# Altium schematic sheet hall_switches.SchDoc
size 431 x 279 mm; SheetNumber: 1; SheetTotal: 1; ENG_APP_DATE: --/--/--; DSN_APP_DATE: --/--/--; CHK_APP_DATE: --/--/--
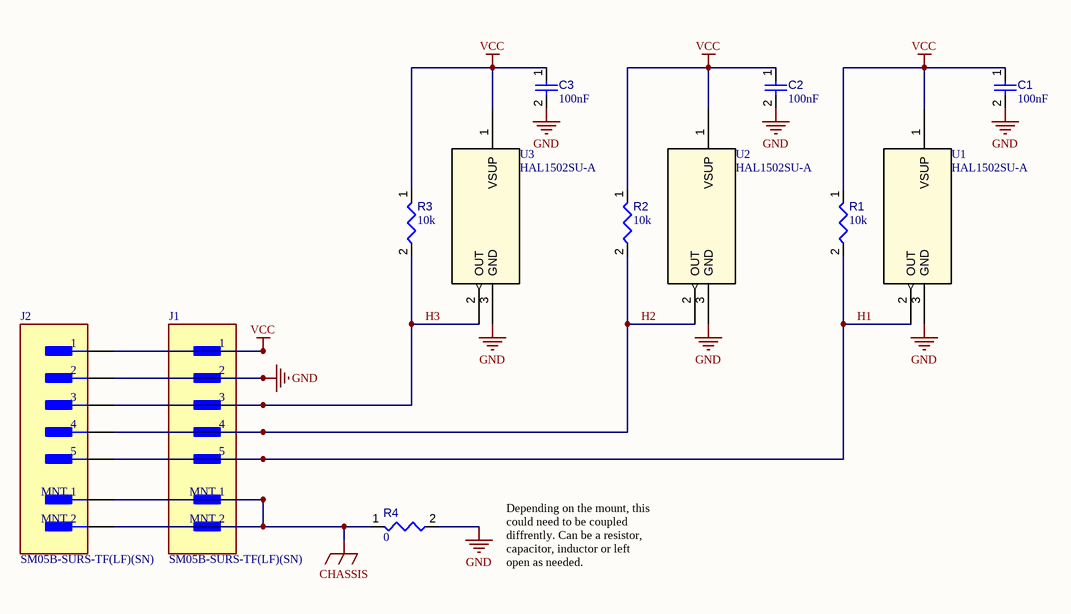
[diagram p0: hall_switches.SchDoc]

## Parts
C1  value 100nF  [CAPC2013X95X50ML10T25]  (hidden comment: Capacitor 100 nF +/-10% 50 V 0805)
C2  value 100nF  [CAPC2013X95X50ML10T25]  (hidden comment: Capacitor 100 nF +/-10% 50 V 0805)
C3  value 100nF  [CAPC2013X95X50ML10T25]  (hidden comment: Capacitor 100 nF +/-10% 50 V 0805)
J1  SM05B-SURS-TF(LF)(SN)  [FP-SM05B-SURS-TF_LF_SN-MFG]
J2  SM05B-SURS-TF(LF)(SN)  [FP-SM05B-SURS-TF_LF_SN-MFG]
R1  value 10k  [RESC2013X50X35ML15T15]  (hidden comment: Resistor 10k +/-1% 0805 125 mW)
R2  value 10k  [RESC2013X50X35ML15T15]  (hidden comment: Resistor 10k +/-1% 0805 125 mW)
R3  value 10k  [RESC2013X50X35ML15T15]  (hidden comment: Resistor 10k +/-1% 0805 125 mW)
R4  0  [RESC0805(2012)_L]
U1  HAL1502SU-A  [SOT-23_TO-236_TDK]
U2  HAL1502SU-A  [SOT-23_TO-236_TDK]
U3  HAL1502SU-A  [SOT-23_TO-236_TDK]

## Nets
CHASSIS: J1.6(MNT_1) J1.7(MNT_2) J2.6(MNT_1) J2.7(MNT_2) R4.1
GND: C1.2 C2.2 C3.2 J1.2 J2.2 R4.2 U1.3(GND) U2.3(GND) U3.3(GND)
VCC: C1.1 C2.1 C3.1 J1.1 J2.1 R1.1 R2.1 R3.1 U1.1(VSUP) U2.1(VSUP) U3.1(VSUP)
H1: J1.5 J2.5 R1.2 U1.2(OUT)
H2: J1.4 J2.4 R2.2 U2.2(OUT)
H3: J1.3 J2.3 R3.2 U3.2(OUT)

## Notes on the sheet
- Depending on the mount, this could need to be coupled diffrently. Can be a resistor, capacitor, inductor or left open as needed.
- DWG. NO.
- REV.
- SHT.
- THIS DOCUMENT AND THE DATA DISCLOSED HEREIN OR HEREWITH IS THE PROPERTY OF ALTIUM LIMITED AND MAY BE FREELY DISTRIBUTED IN WHOLE. NO RIGHTS ARE RESERVED OR EXPRESS OR IMPLIED WARANTEE GIVEN.
- REVISION
- DESCRIPTION
- DATE
- APPROVED
- ENG:
- APPROVALS
- PROJECT
- DSN:
- CHK:
- REFERENCE DOCUMENTS
- PROJECT REVISION:
- TITLE
- DOCUMENT REVISION:
- DESIGN ITEM:
- BOM:
- FAB DWG:
- PCB DWG:
- ASSY DWG:
- SCALE:
- SIZE
- B
- CAGE CODE
- FILE NAME
- DWG NO.
- SHEET
- OF
- REV

## Library data of the parts
C1-C3 = CMP-001-00018-4: Chip Capacitor, 100 nF, +/- 10%, 50 V, 0805 (2012 Metric); Capacitor Type: Ceramic; Voltage Rating: 50V; Pins: 2; Max Operating Temperature: 125°C; Min Operating Temperature: -55°C; Mounting Technology: SM; Case/Package: 0805; RoHS Compliant: True; Tolerance: 10%
J1 J2 = CMP-17439-000553-1: CONN HEADER SMD R/A 5POS 0.8MM; Voltage Rating: 30V; Number of Positions: 5; Insulation Color: Natural; Max Operating Temperature: 85°C; Case/Package: SMD/SMT; Mount: Surface Mount; Packaging: Cut Tape; Width: 2.7mm; Connector Type: Header; Pitch: 0.8mm; Contact Shape: Rectangular; Termination: Solder; Min Operating Temperature: -25°C; Series: SUR; Lead Free: Lead Free; Height: 1.75mm; Flammability Rating: UL94 V-0; Insulation Material: Nylon; Fastening Type: Pull; Contact Material: Copper Alloy; Number of Poles: 5; Contact Type: Outer Shroud Contact; Contact Finish - Mating: TIN; Length: 6.2mm; Number of Rows: 1
R1 R2 = CMP-009-00018-5: Chip Resistor, 10 KOhm, +/- 1%, 125 mW, -55 to 155 degC, 0805 (2012 Metric); Power: 125mW; Voltage Rating: 150V; Tolerance: 1%; Pins: 2; Min Operating Temperature: -55°C; Case/Package: 0805; Max Operating Temperature: 155°C; RoHS Compliant: True; Mounting Technology: SM
R3 = RES-2: Chip Resistor, 10 KOhm, +/- 1%, 125 mW, -55 to 155 degC, 0805 (2012 Metric); Power: 125mW; Voltage Rating: 150V; Tolerance: 1%; Pins: 2; Min Operating Temperature: -55°C; Case/Package: 0805; Max Operating Temperature: 155°C; RoHS Compliant: True; Mounting Technology: SM
R4 = CMP-009-00102-1: 0.125W 5% 0805 (2012 Metric)  SMD; Power: 125mW; Tolerance: 5%; Pins: 2; Case/Package: 0805; Value: 0; Mounting Technology: SMT
U1-U3 = HAL1502SU-A: No Description Available; Mfr_Name: TDK; Copyright: Copyright (C) 2024 Ultra Librarian. All rights reserved.; Manufacturer_Part_Number: HAL1502SU-A; RefDes: RefDes; Type: DEV